# Altium schematic sheet SFP-Interface.SchDoc: SFP Interface Board
size A4; SheetNumber: 1; SheetTotal: 1
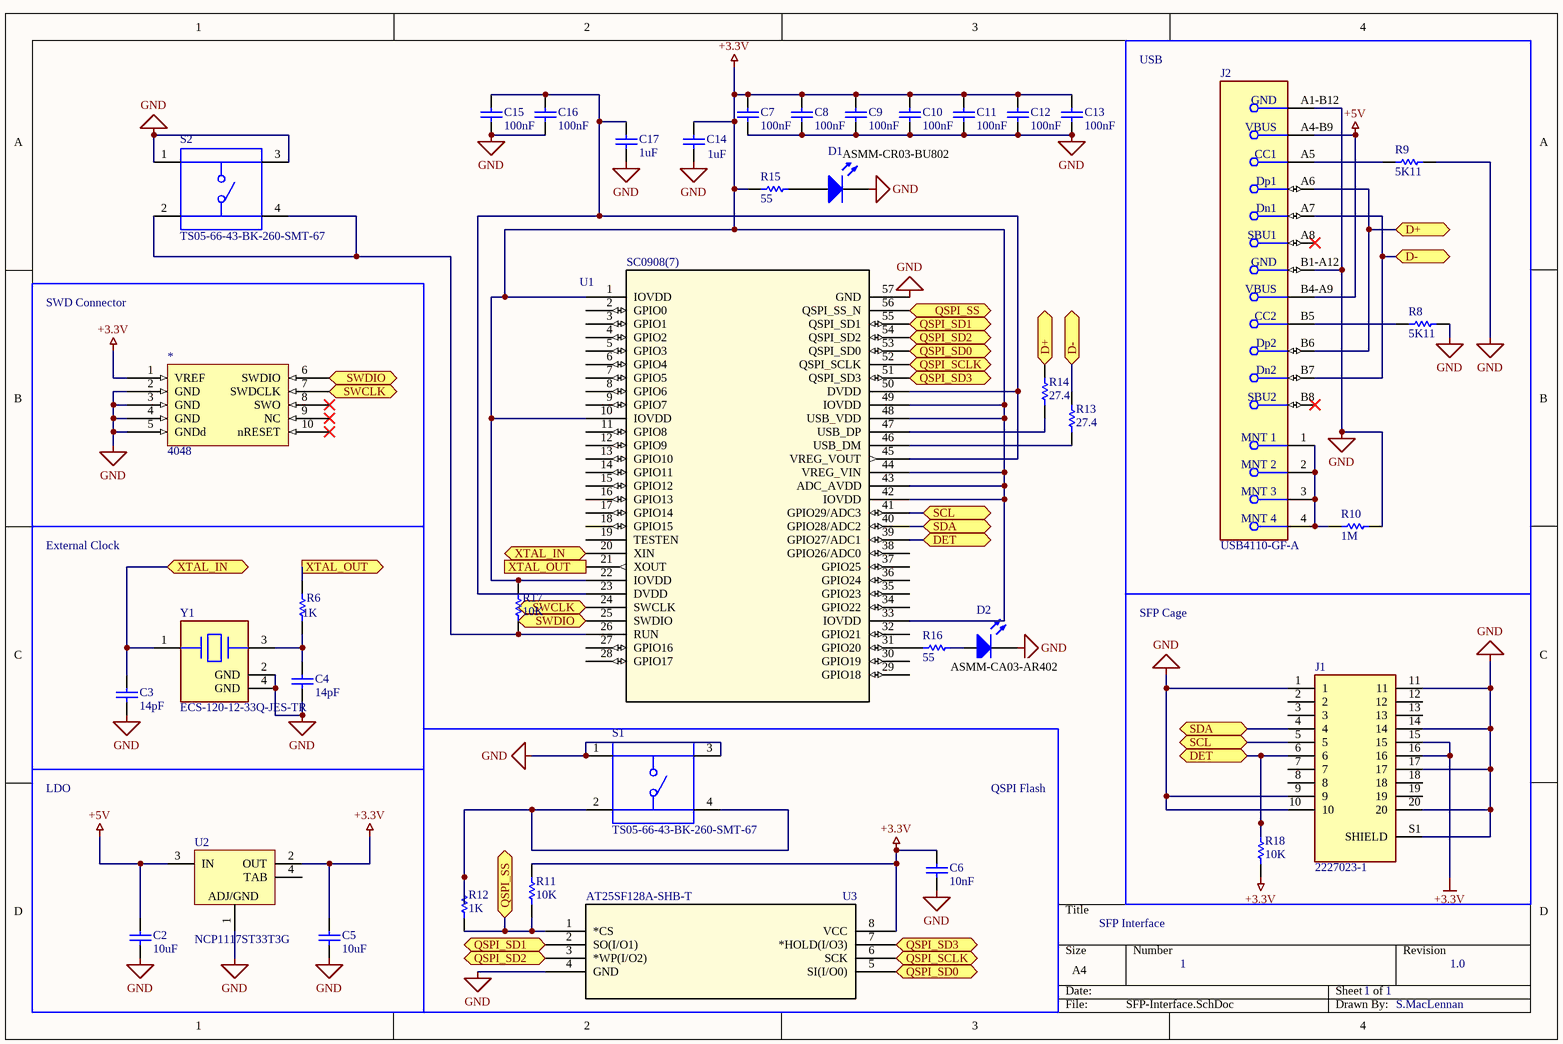
[diagram p0: SFP-Interface.SchDoc]

## Parts
*  4048  [4048-Footprint-1]
C2  value 10uF  [1608[0603]]  (hidden comment: Capacitor)
C3  value 14pF  [1608[0603]]  (hidden comment: Capacitor)
C4  value 14pF  [1608[0603]]  (hidden comment: Capacitor)
C5  value 10uF  [1608[0603]]  (hidden comment: Capacitor)
C6  value 10nF  [1608[0603]]  (hidden comment: Capacitor)
C7  value 100nF  [1608[0603]]  (hidden comment: Capacitor)
C8  value 100nF  [1608[0603]]  (hidden comment: Capacitor)
C9  value 100nF  [1608[0603]]  (hidden comment: Capacitor)
C10  value 100nF  [1608[0603]]  (hidden comment: Capacitor)
C11  value 100nF  [1608[0603]]  (hidden comment: Capacitor)
C12  value 100nF  [1608[0603]]  (hidden comment: Capacitor)
C13  value 100nF  [1608[0603]]  (hidden comment: Capacitor)
C14  value 1uF  [1608[0603]]  (hidden comment: Capacitor)
C15  value 100nF  [1608[0603]]  (hidden comment: Capacitor)
C16  value 100nF  [1608[0603]]  (hidden comment: Capacitor)
C17  value 1uF  [1608[0603]]  (hidden comment: Capacitor)
D1  Light-Emitting Diode  [3.5X2.8X1.9]  (value not drawn)
D2  Light-Emitting Diode  [3.5X2.8X1.9]  (value not drawn)
J1  2227023-1  [TE_2227023-1]
J2  USB4110-GF-A  [FP-USB4110-GF-A-MFG]
R6  value 1K  [1608[0603]]  (hidden comment: Resistor)
R8  value 5K11  [1608[0603]]  (hidden comment: Resistor)
R9  value 5K11  [1608[0603]]  (hidden comment: Resistor)
R10  value 1M  [1608[0603]]  (hidden comment: Resistor)
R11  value 10K  [1608[0603]]  (hidden comment: Resistor)
R12  value 1K  [1608[0603]]  (hidden comment: Resistor)
R13  value 27.4  [1608[0603]]  (hidden comment: Resistor)
R14  value 27.4  [1608[0603]]  (hidden comment: Resistor)
R15  value 55  [1608[0603]]  (hidden comment: Resistor)
R16  value 55  [1608[0603]]  (hidden comment: Resistor)
R17  value 10K  [1608[0603]]  (hidden comment: Resistor)
R18  value 10K  [1608[0603]]  (hidden comment: Resistor)
S1  TS05-66-43-BK-260-SMT-67  [SW_TS05-66-43-BK-260-SMT-67]
S2  TS05-66-43-BK-260-SMT-67  [SW_TS05-66-43-BK-260-SMT-67]
U1  SC0908(7)  [QFN40P700X700X90-57N]
U2  NCP1117ST33T3G  [ONSC-SOT-223-4-318H-01_A_V]
U3  AT25SF128A-SHB-T  [SOIC127P790X216-8N]
Y1  ECS-120-12-33Q-JES-TR  [FP-ECX-33Q-MFG]

## Blocks framed on the sheet
USB: J2 R8-R10
SWD Connector: *
External Clock: C3 C4 R6 Y1
SFP Cage: J1 R18
QSPI Flash: C6 R11 R12 S1 U3
LDO: C2 C5 U2

## Ports
D+ (bidir), D- (bidir), DET (bidir), QSPI_SCLK (bidir), QSPI_SD0 (bidir), QSPI_SD1 (bidir), QSPI_SD2 (bidir), QSPI_SD3 (bidir), QSPI_SS (bidir), SCL (bidir), SDA (bidir), SWCLK (bidir), SWDIO (bidir), XTAL_IN (bidir), XTAL_OUT (out)

## Nets
+3.3V: *.1(VREF) C5.2 C6.2 C7.2 C8.2 C9.2 C10.2 C11.2 C12.2 C13.2 C14.2 J1.15 J1.16 R11.2 R15.2 R17.2 R18.1 U1.1(IOVDD) U1.10(IOVDD) U1.22(IOVDD) U1.33(IOVDD) U1.42(IOVDD) U1.43(ADC_AVDD) U1.44(VREG_VIN) U1.48(USB_VDD) U1.49(IOVDD) U2.2(OUT) U3.8(VCC)
+5V: C2.2 J2.A4-B9(VBUS) J2.B4-A9(VBUS) U2.3(IN)
GND: *.2(GND) *.3(GND) *.4(GND) *.5(GNDd) C2.1 C3.1 C4.1 C5.1 C6.1 C7.1 C8.1 C9.1 C10.1 C11.1 C12.1 C13.1 C14.1 C15.1 C16.1 C17.1 D1.2(K) D2.2(K) J1.1 J1.9 J1.10 J1.11 J1.14 J1.17 J1.20 J1.S1(SHIELD) J2.A1-B12(GND) J2.B1-A12(GND) R8.1 R9.2 R10.2 S1.1 S1.3 S2.1 S2.3 U1.57(GND) U2.1(ADJ/GND) U3.4(GND) Y1.2(GND) Y1.4(GND)
D+: J2.A6(Dp1) J2.B6(Dp2) R14.2 ; port D+
D-: J2.A7(Dn1) J2.B7(Dn2) R13.2 ; port D-
DET: J1.6 R18.2 U1.39(GPIO27/ADC1) ; port DET
QSPI_SCLK: U1.52(QSPI_SCLK) U3.6(SCK) ; port QSPI_SCLK
QSPI_SD0: U1.53(QSPI_SD0) U3.5(SI(I/O0)) ; port QSPI_SD0
QSPI_SD1: U1.55(QSPI_SD1) U3.2(SO(I/O1)) ; port QSPI_SD1
QSPI_SD2: U1.54(QSPI_SD2) U3.3(*WP(I/O2)) ; port QSPI_SD2
QSPI_SD3: U1.51(QSPI_SD3) U3.7(*HOLD(I/O3)) ; port QSPI_SD3
QSPI_SS: R11.1 R12.1 U1.56(QSPI_SS_N) U3.1(*CS) ; port QSPI_SS
SCL: J1.5 U1.41(GPIO29/ADC3) ; port SCL
SDA: J1.4 U1.40(GPIO28/ADC2) ; port SDA
SWCLK: *.7(SWDCLK) U1.24(SWCLK) ; port SWCLK
SWDIO: *.6(SWDIO) U1.25(SWDIO) ; port SWDIO
XTAL_IN: C3.2 U1.20(XIN) Y1.1(In/Out) ; port XTAL_IN
XTAL_OUT: R6.2 U1.21(XOUT) ; port XTAL_OUT
NetC4_2: C4.2 R6.1 Y1.3(Out/In)
NetC15_2: C15.2 C16.2 C17.2 U1.23(DVDD) U1.45(VREG_VOUT) U1.50(DVDD)
NetD1_1: D1.1(A) R15.1
NetD2_1: D2.1(A) R16.1
NetJ2_1: J2.1(MNT_1) J2.2(MNT_2) J2.3(MNT_3) J2.4(MNT_4) R10.1
NetJ2_A5: J2.A5(CC1) R9.1
NetJ2_B5: J2.B5(CC2) R8.2
NetR12_2: R12.2 S1.2 S1.4
NetR13_1: R13.1 U1.46(USB_DM)
NetR14_1: R14.1 U1.47(USB_DP)
NetR16_2: R16.2 U1.31(GPIO20)
NetR17_1: R17.1 S2.2 S2.4 U1.26(RUN)

Not connected (* = marked no-connect by the designer): * 8(SWO)* 9(NC)* 10(nRESET)*; J1 2 3 7 8 12 13 18 19; J2 A8(SBU1)* B8(SBU2)*; U1 2(GPIO0) 3(GPIO1) 4(GPIO2) 5(GPIO3) 6(GPIO4) 7(GPIO5) 8(GPIO6) 9(GPIO7) 11(GPIO8) 12(GPIO9) 13(GPIO10) 14(GPIO11) 15(GPIO12) 16(GPIO13) 17(GPIO14) 18(GPIO15) 19(TESTEN) 27(GPIO16) 28(GPIO17) 29(GPIO18) 30(GPIO19) 32(GPIO21) 34(GPIO22) 35(GPIO23) 36(GPIO24) 37(GPIO25) 38(GPIO26/ADC0); U2 4(TAB)

## Notes on the sheet
- ASMM-CR03-BU802
- ASMM-CA03-AR402
- SFP Interface
- 1
- 1.0
- S.MacLennan

## Library data of the parts
* = CMP-002-00071-2: Mini SWD 0.05" Pitch Connector - 10 Pin SMT Box Header
C2-C17 = Capacitor: SimulationGenericComponent: True
D1 D2 = LED: AF: 1; BV: 0; BV_MAX: 1e99; EG: 1.11; FC: 0.5; IBV: 0.001; IS: 1e-14; MJSW: 0.33; NTUN: 30; TNOM: 27; XTI: 3; SimulationGenericComponent: True; CJO: 0; CJP: 0; CTA: 0; CTP: 0; FCS: 0.5; FV_MAX: 1e99; IKF: 0; IKR: 0; ISR: 1e-14; JSW: 0; JTUN: 0; JTUNSW: 0; KEG: 1; KF: 0; LEVEL: 1; N: 1; NBV: 1; NR: 1; NS: 1; PHP: 1; RS: 0; TCV: 0; TLEV: 0; TLEVC: 0; TM1: 0; TM2: 0; TPB: 0; TPHP: 0; TRS: 0; TRS2: 0; TT: 0; TTT1: 0; TTT2: 0; VJ: 1; XTITUN: 3
J1 = 2227023-1: Connector Accessories 1 Port SFP Cage Press Fit Right Angle Through Hole Nickel Tray; MF: TE Connectivity; EU_RoHS_Compliance: Compliant; SnapEDA_Link: https://www.snapeda.com/parts/2227023-1/TE%20Connectivity%20AMP%20Connectors/view-part/1472255/?ref=snap; Product_Type: Cage; Package: None; MP: 2227023-1; Price: None; TE_purchase_URL: https://www.te.com/usa-en/product-2227023-1.html?te_bu=Cor&te_type=disp&te_campaign=seda_glo_cor-seda-global-disp-prtnr-fy19-seda-model-bom-cta_sma-317_1&elqCampaignId=32493; Availability: Unavailable; Value: *
J2 = CMP-245163-000002-1: CONN USB 2.0 TYPE-C R/A SMT; Manufacturer: GCT; Conn Orientation: Right Angle; Usb Standard: USB 2.0; Voltage Rating: 20V; Current Rating: 3/4.25/1.25/0.25A; Number Of Contacts: 16; Is Female: yes; Shielding: true; Standoff Height: 0.1mm; Octopart: https://octopart.com/usb4110-gf-a-gct-103941985; Temperature: -40°C to +85°C; RoHS: TRUE; Automotive: No; Contact Material: Gold,Nickel; Device Class L1: Connectors; Device Class L2: USB Connectors; Package: 0; Lead Free: Yes; ComponentLink2URL: https://gct.co/files/drawings/usb4110.pdf; Temperature Range High: +85°C; Temperature Range Low: -40°C; Height: 3.46mm; Manufacturer Part Number: USB4110-GF-A; ComponentLink2Description: Datasheet; Device Class L3: unset; Digikey Description: CONN USB 2.0 TYPE-C R/A SMT; Category: Conn
R6 R8-R18 = Resistor: TC1: 0; SimulationGenericComponent: True; TC2: 0
S1 S2 = TS05-66-43-BK-260-SMT-67: 6 x 6 mm, 4.3 ~ 8 mm Actuator Height, 100 ~ 260 gf, Surface Mount, IP67, SPST, Tactile Switch; MF: CUI Devices; Purchase-URL: https://pricing.snapeda.com/search/part/TS05-66-43-BK-260-SMT-67/?ref=eda; Price: None; Check_prices: https://www.snapeda.com/parts/TS05-66-43-BK-260-SMT-67/CUI+Devices/view-part/?ref=eda; CUI_purchase_URL: https://www.cuidevices.com/product/switches/tactile-switches/ts05-series?utm_source=snapeda.com&utm_medium=referral&utm_campaign=snapedaBOM; MP: TS05-66-43-BK-260-SMT-67; Value: *; Package: None; SnapEDA_Link: https://www.snapeda.com/parts/TS05-66-43-BK-260-SMT-67/CUI+Devices/view-part/?ref=snap; Availability: In Stock
U1 = SC0908(7): No Description Available; Mfr_Name: Raspberry Pi; Copyright: Copyright (C) 2022 Ultra Librarian. All rights reserved.; Manufacturer_Part_Number: SC0908(7); Digi-Key_Part_Number_1: 2648-SC0908(7)TR-ND; Digi-Key_Part_Number_2: 2648-SC0908(7)CT-ND; Digi-Key_Part_Number_3: 2648-SC0908(7)DKR-ND; RefDes: RefDes; Type: DEV
U2 = CMP-1679-00010-1: Low-Dropout Positive Fixed Voltage Regulator, 1 A, 3.3 V Output Voltage, 0 to 125 degC, 4-Pin SOT-223 (318H-01), Pb-Free, Tape and Reel; Resistance: 220 kohm; Type (Resistor): Thick Film; Voltage Rating: 75 V; Tolerance: 1%; Case\Package: 0603; Power Rating: 100 mW; Width: 0.85 mm; Weight: 7.1E-05 oz; ComponentLink2URL: http://www.onsemi.com/pub_link/Collateral/NCP1117-D.PDF; RoHSCompliant: true; Height: 0.45 mm; PackageDescription: 4-Pin Small Outline Transistor, Body 6.5 x 3.5 mm, Pitch 2.3 mm; ComponentLink1Description: Manufacturer URL; ComponentLink1URL: http://www.onsemi.com/; PackageReference: SOT-223-4-318H-01_A; Max Operating Temperature: 155 degC; Packaging: Tape and Reel; REACH SVHC: Unknown; Length: 1.55 mm; Package Quantity: 5000; Radiation Hardening: No; Min Operating Temperature: -55 degC; DatasheetVersion: Rev. 27, 09/2014; Mount: Surface Mount; Case Code (Imperial): 0603; Case Code (Metric): 1608; ComponentLink2Description: Datasheet
U3 = AT25SF128A-SHB-T: No Description Available; Mfr_Name: Adesto Technologies; Copyright: Copyright (C) 2022 Ultra Librarian. All rights reserved.; Manufacturer_Part_Number: AT25SF128A-SHB-T; Digi-Key_Part_Number_1: 1265-1348-2-ND; Digi-Key_Part_Number_2: 1265-1348-1-ND; Digi-Key_Part_Number_3: 1265-1348-6-ND; RefDes: RefDes; Type: DEV
Y1 = CMP-40224-000015-1: CRYSTAL 12.000MHZ 12PF SMD; Frequency: 12MHz; ESR (Equivalent Series Resistance): 100R; Frequency Tolerance: 20ppm; Frequency Stability: 50ppm; Ratings: AEC-Q200; Case/Package: SMD/SMT; Load Capacitance: 12pF; Packaging: Tape and Reel; Max Operating Temperature: 125°C; Width: 0.098inch; Min Operating Temperature: -40°C; Mount: Surface Mount; Length: 0.126inch; Height: 0.031inch